# Altium project H_Bridge.PrjPcb
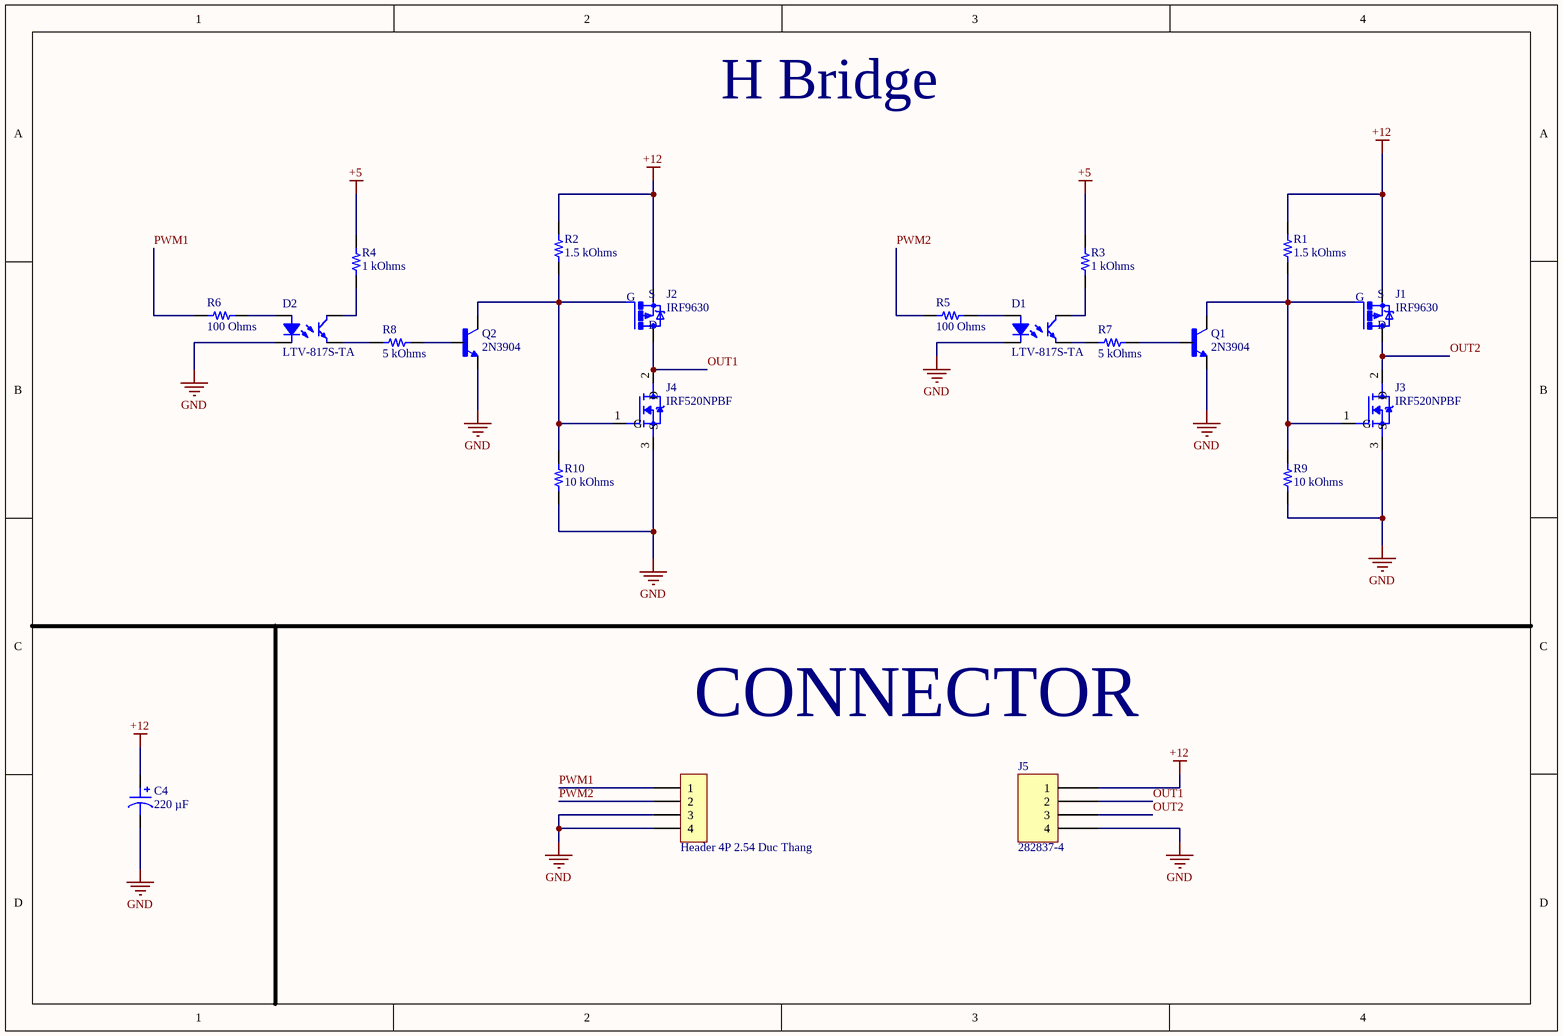
[diagram p0: H_bridge.SchDoc]
2 sheets, 29 parts. Net scope: global (net labels, ports and power ports of the same name join across sheets).
Sheets:
  H_bridge.SchDoc
  Power.SchDoc

## Sheet H_bridge.SchDoc: Motor Driver
size A4; Date: 13/06/2024; Author: TNQ; DrawnBy: TNQ; Organization: Altium Limited; Address1: L3, 12a Rodborough Rd; Address2: Frenchs Forest; Address3: NSW; Address4: Australia 2086

### Parts
C4  220 µF  [CAP ALSMD POLY 8.3MM H10.0MM]
D1  LTV-817S-TA  [LITEON LTV-817]
D2  LTV-817S-TA  [LITEON LTV-817]
H1  Header 4P 2.54 Duc Thang  [XH2.54M-4]
J1  IRF9630  [TO220V]
J2  IRF9630  [TO220V]
J3  IRF520NPBF  [TO-220-3]
J4  IRF520NPBF  [TO-220-3]
J5  282837-4  [TE 282837-4]
Q1  2N3904  [TO92127P495H495-3]
Q2  2N3904  [TO92127P495H495-3]
R1  1.5 kOhms  [RES 0603_1608]
R2  1.5 kOhms  [RES 0603_1608]
R3  1 kOhms  [RES 0603_1608]
R4  1 kOhms  [RES 0603_1608]
R5  100 Ohms  [RES 0603_1608]
R6  100 Ohms  [RES 0603_1608]
R7  5 kOhms  [RES 0603_1608]
R8  5 kOhms  [RES 0603_1608]
R9  10 kOhms  [RES 0603_1608]
R10  10 kOhms  [RES 0603_1608]

### Nets
+5: R3.2 R4.2
+12: C4.1 J1.3(S) J2.3(S) J5.1 R1.2 R2.2
GND: C4.2 D1.2 D2.2 H1.3 H1.4 J3.3(S) J4.3(S) J5.4 Q1.1(E) Q2.1(E) R9.1 R10.1
OUT1: J2.2(D) J4.2(D) J5.2
OUT2: J1.2(D) J3.2(D) J5.3
PWM1: H1.1 R6.1
PWM2: H1.2 R5.1
NetD1_1: D1.1 R5.2
NetD1_3: D1.3 R7.1
NetD1_4: D1.4 R3.1
NetD2_1: D2.1 R6.2
NetD2_3: D2.3 R8.1
NetD2_4: D2.4 R4.1
NetJ1_1: J1.1(G) J3.1(G) Q1.3(C) R1.1 R9.2
NetJ2_1: J2.1(G) J4.1(G) Q2.3(C) R2.1 R10.2
NetQ1_2: Q1.2(B) R7.2
NetQ2_2: Q2.2(B) R8.2

### Notes on the sheet
- H Bridge
- CONNECTOR
- Title
- Size:
- Date:
- A4
- Number:
- Time:
- Revision:
- Sheet
- of
- File:

### Library data of the parts
C4 = PCR1E221MCL6GS: CAP ALUM POLY 220UF 20% 25V SMD; manufacturer: Nichicon; ESR (Equivalent Series Resistance): 20mOhm; Lifetime @ Temp.: 4000 Hrs @ 125°C; Ripple Current @ High Frequency: 3.2 A @ 100 kHz; Surface Mount Land Size: 0.327" L x 0.327" W (8.30mm x 8.30mm); Type: Polymer; Part Number: PCR1E221MCL6GS; Applications: Automotive; Capacitance: 220 µF; componentlink1description: Datasheet; componentlink1url: http://nichicon-us.com/english/products/pdfs/e-pcr.pdf; componentlink2description: DigiKey Link; componentlink2url: https://www.digikey.com/en/products/detail/nichicon/PCR1E221MCL6GS/4694660; Device Package: Radial, Can - SMD; Height - Seated (Max): 0.394" (10.00mm); lastupdated: 6/3/2024 8:16:55 PM; Lifecycle Status: Active; Minimum Order: 1; Mounting Type: Surface Mount; Operating Temperature: -55°C ~ 125°C; Package / Case: Radial, Can - SMD; packaging: TapeAndReel; partid: 2564; Part Status: Active; price: 1.04; Ratings: AEC-Q200; series: PCR; Size / Dimension: 0.315" Dia (8.00mm); Supplier 1: DigiKey; Supplier Part Number 1: 493-13752-1-ND; Tolerance: ±20%; value: 220 µF; Voltage - Rated: 25 V
D1 D2 = LTV-817S-TA: OPTOISOLATR 5KV TRANSISTOR 4-SMD; Manufacturer: Lite-On Inc.; Current - DC Forward (If) (Max): 50mA; Current Transfer Ratio (Max): 600% @ 5mA; Current Transfer Ratio (Min): 50% @ 5mA; Input Type: DC; Number of Channels: 1; Rise / Fall Time (Typ): 4µs, 3µs; Vce Saturation (Max): 200mV; Voltage - Forward (Vf) (Typ): 1.2V; Voltage - Isolation: 5000Vrms; Voltage - Output (Max): 35V; Part Number: LTV-817S-TA; ComponentLink1Description: Datasheet; ComponentLink1URL: http://optoelectronics.liteon.com/upload/download/DS-70-96-0016/LTV-8X7%20series%20201610%20.pdf; ComponentLink2Description: DigiKey Link; ComponentLink2URL: http://digikey.com/product-detail/en/lite-on-inc/LTV-817S-TA/160-2038-1-ND/3711420; Current - Output / Channel: 50mA; Device Package: 4-SMD, Gull Wing; LastUpdated: 1/12/2020 9:59:02 PM; Lifecycle Status: Active; Minimum Order: 1; Mounting Type: Surface Mount; Operating Temperature: -30°C ~ 110°C; Output Type: Transistor; Package / Case: 4-SMD, Gull Wing; Packaging: TapeAndReel; Part Status: Active; Price: 0.12; Series: -; Supplier 1: DigiKey; Supplier Part Number 1: 160-2038-1-ND; Supplier Device Package: 4-SMD
H1 = Header 4P 2.54 Duc Thang: Cắm; Ten_Linh_Kien: Header 4P XH2.54-4P Đực Thẳng; Don_Vi: Con; Ma_Hang: MH001285; Chung_Loai: Cắm
J1 J2 = IRF9630: Trans MOSFET P-CH 200V 6.5A 3-Pin(3+Tab) TO-220AB Trans MOSFET P-CH 200V 6.5A 3-Pin(3+Tab) TO-220AB Trans MOSFET P-CH 200V 6.5A 3-Pin(3+Tab) TO-220AB; MF: Vishay Siliconix; MP: IRF9630; SnapEDA_Link: https://www.snapeda.com/parts/IRF9630/Vishay+Siliconix/view-part/?ref=snap; Availability: In Stock; Package: TO-220-3 Vishay; Purchase-URL: https://pricing.snapeda.com/search/part/IRF9630/?ref=eda; Check_prices: https://www.snapeda.com/parts/IRF9630/Vishay+Siliconix/view-part/?ref=eda; Value: *; Price: None
J3 J4 = IRF520NPBF: N-Channel 100V 9.7A _Tc_ 48W _Tc_ Through Hole TO-220AB; MF: Infineon Technologies; MP: IRF520NPBF; Package: TO-220AB International Rectifier; Price: None; Availability: Unavailable; Value: *; SnapEDA_Link: https://www.snapeda.com/parts/IRF520NPBF/Infineon%20Technologies/view-part/106191/?ref=snap
J5 = 282837-4: TERM BLK 4P SIDE ENT 5.08MM PCB; Manufacturer: TE Connectivity AMP Connectors; Current: 13.5 A; Mating Orientation: Horizontal with Board; Number of Levels: 1; Pitch: 0.200" (5.08mm); Positions Per Level: 4; Voltage: 300 V; Wire Gauge: 16-28 AWG; Wire Termination: Screw - Rising Cage Clamp; Part Number: 282837-4; Color: Green; ComponentLink1Description: Datasheet; ComponentLink1URL: https://www.te.com/commerce/DocumentDelivery/DDEController?Action=srchrtrv&DocNm=282837&DocType=Customer+Drawing&DocLang=English; ComponentLink2Description: DigiKey Link; ComponentLink2URL: https://www.digikey.com/en/products/detail/te-connectivity-amp-connectors/282837-4/2187975; Features: Interlocking (Side); LastUpdated: 6/21/2022 3:00:53 PM; Lifecycle Status: Active; Minimum Order: 1; Mounting Type: Through Hole; Packaging: Tray; Part Status: Active; Price: 0.62; Series: Buchanan; Supplier 1: DigiKey; Supplier Part Number 1: A124423-ND
Q1 Q2 = 2N3904: TRANS NPN 40V 200MA TO92-3; MF: Rectron; SnapEDA_Link: https://www.snapeda.com/parts/2N3904/Rectron/view-part/?ref=snap; Package: TO-226-3 Rectron; MP: 2N3904; Check_prices: https://www.snapeda.com/parts/2N3904/Rectron/view-part/?ref=eda; Purchase-URL: https://pricing.snapeda.com/search/part/2N3904/?ref=eda; Price: None; Value: *; Availability: In Stock
R1 R2 = RP0603BRD071K5L: RES 1.5K OHM 0.1% 1/10W 0603; Manufacturer: Yageo; Power (Watts): 0.1W, 1/10W; Temperature Coefficient: ±25ppm/°C; Part Number: RP0603BRD071K5L; Value: 1.5 kOhms; ComponentLink1Description: Datasheet; ComponentLink1URL: https://www.yageo.com/upload/media/product/products/datasheet/rchip/PYu-RP_51_RoHS_L_0.pdf; ComponentLink2Description: DigiKey Link; ComponentLink2URL: https://www.digikey.com/en/products/detail/yageo/RP0603BRD071K5L/16916652; Composition: Thin Film; Device Package: 0603 (1608 Metric); Features: Anti-Sulfur, Automotive AEC-Q200, Moisture Resistant; Height - Seated (Max): 0.022" (0.55mm); LastUpdated: 2/9/2024 8:40:52 PM; Lifecycle Status: Active; Minimum Order: 1; Number of Terminations: 2; Operating Temperature: -55°C ~ 155°C; Package / Case: 0603 (1608 Metric); Packaging: TapeAndReel; PartId: 70840; Part Status: Active; Price: 0.05; Resistance: 1.5 kOhms; Series: RP; Size / Dimension: 0.063" L x 0.031" W (1.60mm x 0.80mm); Supplier 1: DigiKey; Supplier Part Number 1: 13-RP0603BRD071K5LCT-ND; Supplier Device Package: 0603; Tolerance: ±0.1%
R3 R4 = RP0603BRD071KL: RES 1K OHM 0.1% 1/10W 0603; Manufacturer: Yageo; Power (Watts): 0.1W, 1/10W; Temperature Coefficient: ±25ppm/°C; Part Number: RP0603BRD071KL; Value: 1 kOhms; ComponentLink1Description: Datasheet; ComponentLink1URL: https://www.yageo.com/upload/media/product/products/datasheet/rchip/PYu-RP_51_RoHS_L_0.pdf; ComponentLink2Description: DigiKey Link; ComponentLink2URL: https://www.digikey.com/en/products/detail/yageo/RP0603BRD071KL/16916487; Composition: Thin Film; Device Package: 0603 (1608 Metric); Features: Anti-Sulfur, Automotive AEC-Q200, Moisture Resistant; Height - Seated (Max): 0.022" (0.55mm); LastUpdated: 2/9/2024 8:40:52 PM; Lifecycle Status: Active; Minimum Order: 1; Number of Terminations: 2; Operating Temperature: -55°C ~ 155°C; Package / Case: 0603 (1608 Metric); Packaging: TapeAndReel; PartId: 70838; Part Status: Active; Price: 0.05; Resistance: 1 kOhms; Series: RP; Size / Dimension: 0.063" L x 0.031" W (1.60mm x 0.80mm); Supplier 1: DigiKey; Supplier Part Number 1: 13-RP0603BRD071KLCT-ND; Supplier Device Package: 0603; Tolerance: ±0.1%
R5 R6 = MCT06030D1000BP100: RES SMD 100 OHM 0.1% 1/10W 0603; Manufacturer: Vishay Beyschlag; Power (Watts): 0.1W, 1/10W; Temperature Coefficient: ±25ppm/°C; Part Number: MCT06030D1000BP100; Value: 100 Ohms; ComponentLink1Description: Datasheet; ComponentLink1URL: http://www.vishay.com/docs/28700/mcx0x0xpre.pdf; ComponentLink2Description: DigiKey Link; ComponentLink2URL: http://digikey.com/product-detail/en/vishay-beyschlag/MCT06030D1000BP100/749-1689-1-ND/7347997; Composition: Thin Film; Device Package: 0603 (1608 Metric); Features: Anti-Sulfur; Height - Seated (Max): 0.022" (0.55mm); LastUpdated: 2/9/2024 8:42:47 PM; Lifecycle Status: Active; Minimum Order: 1; Number of Terminations: 2; Operating Temperature: -55°C ~ 125°C; Package / Case: 0603 (1608 Metric); Packaging: TapeAndReel; PartId: 17608; Part Status: Active; Price: 0.17; Resistance: 100 Ohms; Series: MCT - Precision; Size / Dimension: 0.061" L x 0.033" W (1.55mm x 0.85mm); Supplier 1: DigiKey; Supplier Part Number 1: 749-1689-1-ND; Supplier Device Package: 0603; Tolerance: ±0.1%
R7 R8 = PNM0603E5001BST5: RES SMD 5K OHM 0.1% 0.15W 0603; Manufacturer: Vishay Thin Film; Temperature Coefficient: ±25ppm/°C; Part Number: PNM0603E5001BST5; Value: 5 kOhms; ComponentLink1Description: Datasheet; ComponentLink1URL: http://www.vishay.com/docs/60057/pnm.pdf; ComponentLink2Description: DigiKey Link; ComponentLink2URL: http://digikey.com/product-detail/en/vishay-thin-film/PNM0603E5001BST5/PNM0603-5.0KBCT-ND/2120383; Composition: Thin Film; Device Package: 0603 (1608 Metric); Features: Anti-Sulfur, Moisture Resistant, Non-Inductive, Non-Magnetic; Height - Seated (Max): 0.020" (0.51mm); LastUpdated: 2/9/2024 8:43:09 PM; Lifecycle Status: Active; Minimum Order: 1; Number of Terminations: 2; Operating Temperature: -55°C ~ 155°C; Package / Case: 0603 (1608 Metric); Packaging: TapeAndReel; PartId: 11960; Part Status: Active; Power (Watts): 0.15W; Price: 1.43; Resistance: 5 kOhms; Series: PNM; Size / Dimension: 0.064" L x 0.032" W (1.63mm x 0.81mm); Supplier 1: DigiKey; Supplier Part Number 1: PNM0603-5.0KBCT-ND; Supplier Device Package: 0603; Tolerance: ±0.1%
R9 R10 = CRT0603-BY-1002EAS: RES SMD 10K OHM 1/10W 0.1% 0603; Manufacturer: Bourns Inc.; Power (Watts): 0.1W, 1/10W; Temperature Coefficient: ±25ppm/°C; Part Number: CRT0603-BY-1002EAS; Value: 10 kOhms; ComponentLink1Description: Datasheet; ComponentLink1URL: https://www.bourns.com/docs/Product-Datasheets/CRT-AS.pdf; ComponentLink2Description: DigiKey Link; ComponentLink2URL: https://www.digikey.com/en/products/detail/bourns-inc/CRT0603-BY-1002EAS/5992173; Composition: Thin Film; Device Package: 0603 (1608 Metric); Features: Anti-Sulfur, Current Sense; Height - Seated (Max): 0.024" (0.60mm); LastUpdated: 2/9/2024 8:43:18 PM; Lifecycle Status: Active; Minimum Order: 1; Number of Terminations: 2; Operating Temperature: -55°C ~ 155°C; Package / Case: 0603 (1608 Metric); Packaging: TapeAndReel; PartId: 9427; Part Status: Active; Price: 0.07; Resistance: 10 kOhms; Series: CRT-AS; Size / Dimension: 0.061" L x 0.031" W (1.55mm x 0.80mm); Supplier 1: DigiKey; Supplier Part Number 1: CRT0603-BY-1002EASCT-ND; Supplier Device Package: 0603; Tolerance: ±0.1%

## Sheet Power.SchDoc
size A4; Organization: Altium Limited; Address1: L3, 12a Rodborough Rd; Address2: Frenchs Forest; Address3: NSW; Address4: Australia 2086
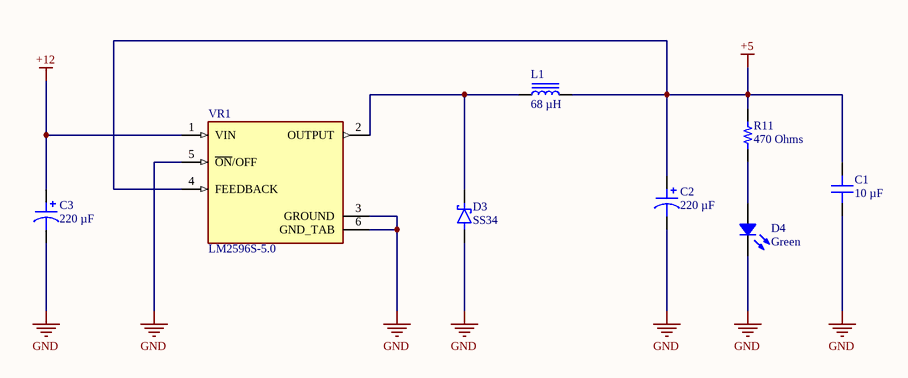
[diagram p1: Power.SchDoc]

### Parts
C1  10 µF  [CAP 0603_1608]
C2  220 µF  [CAP ALSMD 8.3MM H10.5MM]
C3  220 µF  [CAP ALSMD 8.3MM H10.5MM]
D3  SS34  [DIOM7959X265N]
D4  Green  [LED 0402_1005 GREEN]
L1  68 µH  [WURTH WE-PD 1210]
R11  470 Ohms  [RES 0603_1608]
VR1  LM2596S-5.0  [TO170P1524X483-6N]

### Nets
+5: C1.2 C2.1 L1.2 R11.2 VR1.4(FEEDBACK)
+12: C3.1 VR1.1(VIN)
GND: C1.1 C2.2 C3.2 D3.A D4.2 VR1.3(GROUND) VR1.5(~{ON}/OFF) VR1.6(GND_TAB)
NetD3_C: D3.C(K) L1.1 VR1.2(OUTPUT)
NetD4_1: D4.1 R11.1

### Notes on the sheet
- Title
- Size:
- Date:
- A4
- Number:
- Time:
- Revision:
- Sheet
- of
- File:

### Library data of the parts
C1 = TMK107BBJ106MA-T: CAP CER 10UF 25V X5R 0603; manufacturer: Taiyo Yuden; Tolerance: ±20%; Part Number: TMK107BBJ106MA-T; Value: 10 µF; Applications: SMPS Filtering; Capacitance: 10 µF; componentlink1description: Datasheet; componentlink1url: https://ds.yuden.co.jp/TYCOMPAS/ut/detail?pn=TMK107BBJ106MA-T &u=M; componentlink2description: DigiKey Link; componentlink2url: https://www.digikey.com/en/products/detail/taiyo-yuden/TMK107BBJ106MA-T/7403921; Device Package: 0603 (1608 Metric); lastupdated: 2/9/2024 8:10:22 PM; Lifecycle Status: Active; Minimum Order: 1; Mounting Type: Surface Mount, MLCC; Operating Temperature: -55°C ~ 85°C; Package / Case: 0603 (1608 Metric); packaging: TapeAndReel; partid: 8967; Part Status: Active; price: 0.07; series: M; Size / Dimension: 0.063" L x 0.031" W (1.60mm x 0.80mm); Supplier 1: DigiKey; Supplier Part Number 1: 587-6023-1-ND; Temperature Coefficient: X5R; Thickness (Max): 0.039" (1.00mm); Voltage - Rated: 25V
C2 C3 = VZH221M1ETR-0810S: CAP ALUM 220UF 20% 25V SMD; manufacturer: SURGE; Impedance: 170 mOhms; Lifetime @ Temp.: 5000 Hrs @ 105°C; Polarization: Polar; Ripple Current @ High Frequency: 450 mA @ 100 kHz; Surface Mount Land Size: 0.327" L x 0.327" W (8.30mm x 8.30mm); Part Number: VZH221M1ETR-0810S; Applications: General Purpose; Capacitance: 220 µF; componentlink1description: Datasheet; componentlink1url: https://www.surgecomponents.com/pdf/VZH.pdf; componentlink2description: DigiKey Link; componentlink2url: https://www.digikey.com/en/products/detail/surge/VZH221M1ETR-0810S/12451632; Height - Seated (Max): 0.413" (10.50mm); lastupdated: 6/3/2024 8:15:42 PM; Lifecycle Status: Active; Minimum Order: 1; Mounting Type: Surface Mount; Operating Temperature: -55°C ~ 105°C; packaging: CutTape; partid: 28093; Part Status: Active; price: 0.25; series: VZH; Size / Dimension: 0.315" Dia (8.00mm); Supplier 1: DigiKey; Supplier Part Number 1: 4403-VZH221M1ETR-0810SCT-ND; Tolerance: ±20%; value: 220 µF; Voltage - Rated: 25 V
D3 = SS34: Diode Schottky 40 V 3A Surface Mount SMC (DO-214AB); MF: onsemi; SnapEDA_Link: https://www.snapeda.com/parts/SS34/Onsemi/view-part/?ref=snap; Package: SMC-2 ON Semiconductor; Value: *; MP: SS34; Check_prices: https://www.snapeda.com/parts/SS34/Onsemi/view-part/?ref=eda
D4 = XZVGR68W-3: LED GREEN CLEAR 0402 SMD; Manufacturer: SunLED; Configuration: Standard; Current - Test: 20mA; Lens Color: Colorless; Lens Size: 0.60mm x 0.50mm; Lens Style: Rectangle with Flat Top; Millicandela Rating: 34mcd; Viewing Angle: 120°; Voltage - Forward (Vf) (Typ): 2V; Wavelength - Dominant: 571nm; Wavelength - Peak: 572nm; Part Number: XZVGR68W-3; Color: Green; ComponentLink1Description: Datasheet; ComponentLink1URL: https://www.sunledusa.com/products/spec/XZVGR68W-3.pdf; ComponentLink2Description: DigiKey Link; ComponentLink2URL: https://www.digikey.com/en/products/detail/sunled/XZVGR68W-3/6615530; Device Package: 0402 (1005 Metric); Height (Max): 0.25mm; LastUpdated: 6/3/2024 7:58:14 PM; Lens Transparency: Clear; Lifecycle Status: Active; Minimum Order: 1; Mounting Type: Surface Mount; Package / Case: 0402 (1005 Metric); Packaging: TapeAndReel; PartId: 718; Part Status: Active; Price: 0.08; Series: -; Size / Dimension: 1.00mm L x 0.50mm W; Supplier 1: DigiKey; Supplier Part Number 1: 1497-1386-1-ND; Supplier Device Package: 0402; Value: Green
L1 = 7447709680: FIXED IND 68UH 3.2A 89 MOHM SMD; Manufacturer: Würth Elektronik; Current - Saturation: 3.6A; DC Resistance (DCR): 89mOhm Max; Frequency - Self Resonant: 5.5MHz; Inductance Frequency - Test: 1 kHz; Material - Core: Ferrite; Shielding: Shielded; Tolerance: ±20%; Type: Drum Core, Wirewound; Part Number: 7447709680; ComponentLink1Description: Datasheet; ComponentLink1URL: https://katalog.we-online.de/pbs/datasheet/7447709680.pdf; ComponentLink2Description: DigiKey Link; ComponentLink2URL: https://www.digikey.com/en/products/detail/würth-elektronik/7447709680/1638652; Current Rating (Amps): 3.2 A; Device Package: Nonstandard; Height - Seated (Max): 0.394" (10.00mm); Inductance: 68 µH; LastUpdated: 6/3/2024 8:26:17 PM; Lifecycle Status: Active; Minimum Order: 1; Mounting Type: Surface Mount; Operating Temperature: -40°C ~ 125°C; Package / Case: Nonstandard; Packaging: TapeAndReel; PartId: 5691; Part Status: Active; Price: 1.48; Ratings: AEC-Q200; Series: WE-PD; Size / Dimension: 0.472" L x 0.472" W (12.00mm x 12.00mm); Supplier 1: DigiKey; Supplier Part Number 1: 732-1247-1-ND; Supplier Device Package: 1212; Value: 68 µH
R11 = RN73R1JTTD4700B25: RES 470 OHM 0.1% 1/10W 0603; Manufacturer: KOA Speer Electronics, Inc.; Power (Watts): 0.1W, 1/10W; Temperature Coefficient: ±25ppm/°C; Part Number: RN73R1JTTD4700B25; Value: 470 Ohms; ComponentLink1Description: Datasheet; ComponentLink1URL: https://media.digikey.com/pdf/Data%20Sheets/KOA%20Speer/RN73R_Type_DS.pdf; ComponentLink2Description: DigiKey Link; ComponentLink2URL: https://www.digikey.com/en/products/detail/koa-speer-electronics-inc/RN73R1JTTD4700B25/10017891; Composition: Thin Film; Device Package: 0603 (1608 Metric); Features: Automotive AEC-Q200, Moisture Resistant; Height - Seated (Max): 0.022" (0.55mm); LastUpdated: 2/9/2024 8:40:55 PM; Lifecycle Status: Active; Minimum Order: 1; Number of Terminations: 2; Operating Temperature: -55°C ~ 155°C; Package / Case: 0603 (1608 Metric); Packaging: TapeAndReel; PartId: 71186; Part Status: Active; Price: 0.05; Ratings: AEC-Q200; Resistance: 470 Ohms; Series: RN73R; Size / Dimension: 0.063" L x 0.031" W (1.60mm x 0.80mm); Supplier 1: DigiKey; Supplier Part Number 1: 2019-RN73R1JTTD4700B25CT-ND; Supplier Device Package: 0603; Tolerance: ±0.1%
VR1 = LM2596S-5.0: SIMPLE SWITCHER&reg; 4.5V to 40V, 3A Low Component Count Step-Down Regulator; MP: LM2596S-5.0/NOPB; MF: Texas Instruments; Price: None; Availability: In Stock; Package: TO-263-5 Texas Instruments; SnapEDA_Link: https://www.snapeda.com/parts/LM2596S-5.0/NOPB/Texas+Instruments/view-part/?ref=snap; Check_prices: https://www.snapeda.com/parts/LM2596S-5.0/NOPB/Texas+Instruments/view-part/?ref=eda; Value: *; Purchase-URL: https://pricing.snapeda.com/search/part/LM2596S-5.0/NOPB/?ref=eda

## Nets that join several sheets
+5: H_bridge (R3.2 R4.2), Power (5 pins)
+12: H_bridge (6 pins), Power (C3.1 VR1.1)
GND: H_bridge (12 pins), Power (8 pins)